# EAGLE schematic SNES_RGBAmp (EAGLE 7.5.0)
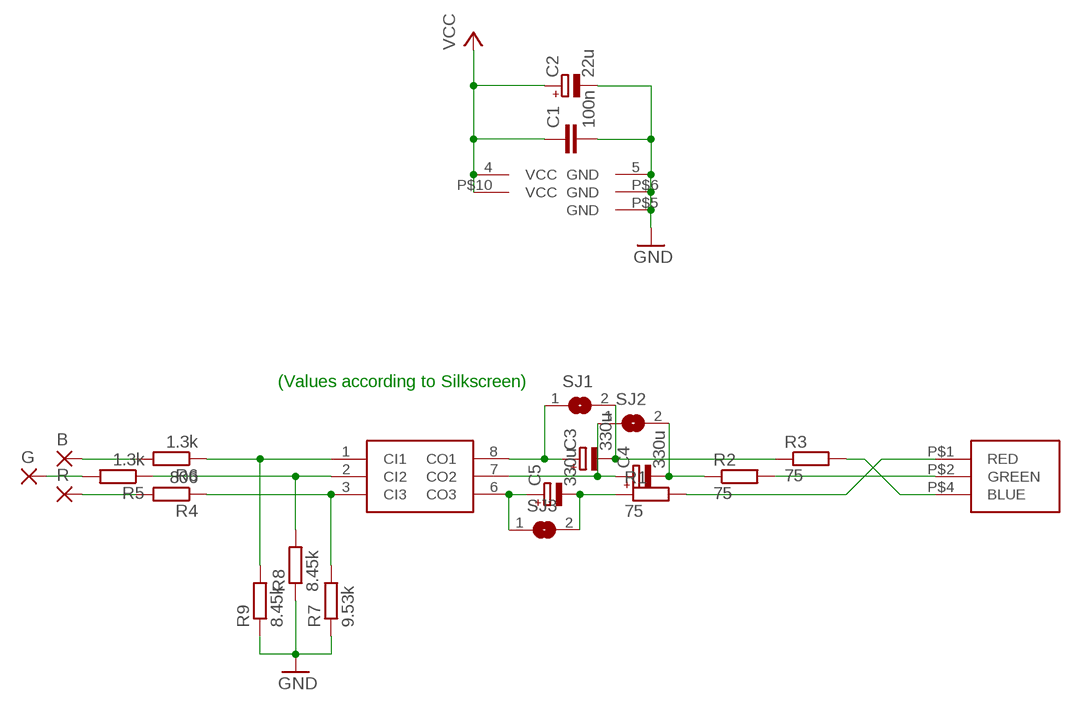
[diagram p0: schematic, sheet 1]

## Parts
B  SMD2  [SMD1,27-2,54]
C1  100n  C0805  [Z0805]
C2  22u  CPOL-EUSMCC  [SMC_C]
C3  330u  CPOL-EUSMCD  [SMC_D]
C4  330u  CPOL-EUSMCD  [SMC_D]
C5  330u  CPOL-EUSMCD  [SMC_D]
G  SMD2  [SMD1,27-2,54]
R  SMD2  [SMD1,27-2,54]
R1  75  R0805  [Z0805]
R2  75  R0805  [Z0805]
R3  75  R0805  [Z0805]
R4  806  R0805  [Z0805]
R5  1.3k  R0805  [Z0805]
R6  1.3k  R0805  [Z0805]
R7  9.53k  R0805  [Z0805]
R8  8.45k  R0805  [Z0805]
R9  8.45k  R0805  [Z0805]
SJ1  SJ  [SJ]
SJ2  SJ  [SJ]
SJ3  SJ  [SJ]
U$1  THS7314  [THS7314]
U$2  SNES_MULTIAV_RGB_ONLY  [SNES_MULTIAV_RGB_ONLY]

## Nets
GND: C1.2 C2.- R7.1 R8.1 R9.1 U$1.5(GND) U$2.P$5(GND) U$2.P$6(GND)
N$1: R6.1 R9.2 U$1.1(CI1)
N$2: R5.1 R8.2 U$1.2(CI2)
N$3: R4.1 R7.2 U$1.3(CI3)
N$4: C3.- R3.1 SJ1.2
N$5: R3.2 U$2.P$4(BLUE)
N$6: R2.2 U$2.P$2(GREEN)
N$7: C4.+ SJ2.1 U$1.7(CO2)
N$8: C5.- R1.1 SJ3.2
N$9: R1.2 U$2.P$1(RED)
N$11: C5.+ SJ3.1 U$1.6(CO3)
N$12: C3.+ SJ1.1 U$1.8(CO1)
N$13: C4.- R2.1 SJ2.2
N$14: B.1(P) R6.2
N$15: G.1(P) R5.2
N$16: R4.2 R.1(P)
VCC: C1.1 C2.+ U$1.4(VCC) U$2.P$10(VCC)

## Notes on the sheet
- (Values according to Silkscreen)

## Library data of the parts
B G R = wirepad:SMD2: SMD PAD
C1 = snescart:C0805
C2-C5 = rcl:CPOL-EU: POLARIZED CAPACITOR, European symbol
R1-R9 = snescart:R0805
SJ1-SJ3 = jumper:SJ: SMD solder JUMPER
U$1 = snescart:THS7314
U$2 = snes_div:SNES_MULTIAV_RGB_ONLY